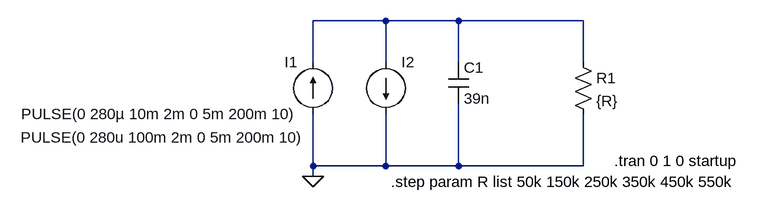
[diagram p0: schematic piezo_model.asc]
piezo_model.asc, the LTspice schematic file:
Version 4
SHEET 1 912 680
WIRE 288 48 176 48
WIRE 400 48 288 48
WIRE 592 48 400 48
WIRE 176 112 176 48
WIRE 288 112 288 48
WIRE 400 112 400 48
WIRE 592 112 592 48
WIRE 176 272 176 192
WIRE 288 272 288 192
WIRE 288 272 176 272
WIRE 400 272 400 176
WIRE 400 272 288 272
WIRE 592 272 592 192
WIRE 592 272 400 272
WIRE 176 288 176 272
FLAG 176 288 0
SYMBOL current 176 192 R180
WINDOW 0 24 80 Left 2
WINDOW 3 24 0 Left 2
WINDOW 123 0 0 Left 2
WINDOW 39 0 0 Left 2
SYMATTR InstName I1
SYMATTR Value PULSE(0 280µ 10m 2m 0 5m 200m 10)
SYMBOL current 288 112 R0
WINDOW 3 -562 116 Left 2
WINDOW 123 0 0 Left 2
WINDOW 39 0 0 Left 2
SYMATTR InstName I2
SYMATTR Value PULSE(0 280u 100m 2m 0 5m 200m 10)
SYMBOL cap 384 112 R0
SYMATTR InstName C1
SYMATTR Value 39n
SYMBOL res 576 96 R0
SYMATTR InstName R1
SYMATTR Value {R}
TEXT 640 264 Left 2 !.tran 0 1 0 startup
TEXT 296 296 Left 2 !.step param R list 50k 150k 250k 350k 450k 550k

The netlist it stands for:
* piezo_model.asc
I1 0 N001 PULSE(0 280µ 10m 2m 0 5m 200m 10)
I2 N001 0 PULSE(0 280u 100m 2m 0 5m 200m 10)
C1 N001 0 39n
R1 N001 0 {R}
.tran 0 1 0 startup
.step param R list 50k 150k 250k 350k 450k 550k
.backanno
.end